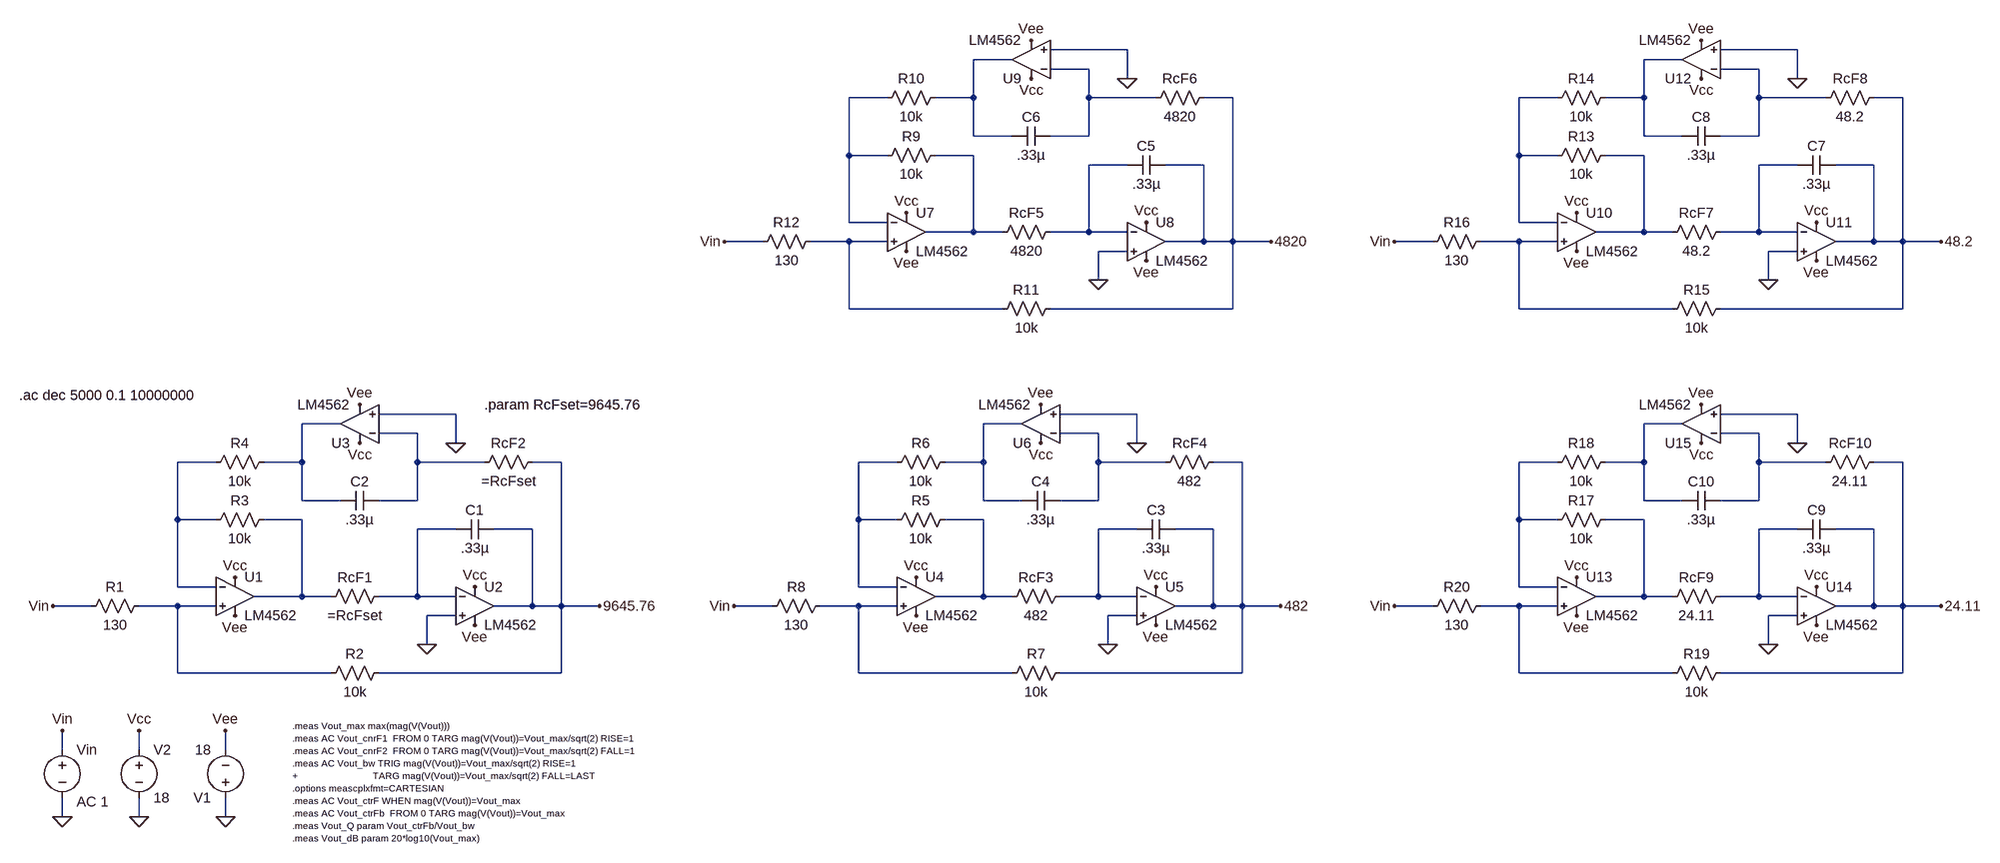
[diagram p0: schematic State-Variable Band Pass Testing.asc]
State-Variable Band Pass Testing.asc, the LTspice schematic file:
Version 4
SHEET 1 3892 728
WIRE 2432 -1712 2304 -1712
WIRE 3568 -1712 3440 -1712
WIRE 2240 -1696 2176 -1696
WIRE 3376 -1696 3312 -1696
WIRE 2368 -1680 2304 -1680
WIRE 3504 -1680 3440 -1680
WIRE 2432 -1664 2432 -1712
WIRE 3568 -1664 3568 -1712
WIRE 2032 -1632 1968 -1632
WIRE 2176 -1632 2176 -1696
WIRE 2176 -1632 2112 -1632
WIRE 2368 -1632 2368 -1680
WIRE 2480 -1632 2368 -1632
WIRE 2608 -1632 2560 -1632
WIRE 3168 -1632 3104 -1632
WIRE 3312 -1632 3312 -1696
WIRE 3312 -1632 3248 -1632
WIRE 3504 -1632 3504 -1680
WIRE 3616 -1632 3504 -1632
WIRE 3744 -1632 3696 -1632
WIRE 2176 -1568 2176 -1632
WIRE 2240 -1568 2176 -1568
WIRE 2368 -1568 2368 -1632
WIRE 2368 -1568 2304 -1568
WIRE 3312 -1568 3312 -1632
WIRE 3376 -1568 3312 -1568
WIRE 3504 -1568 3504 -1632
WIRE 3504 -1568 3440 -1568
WIRE 1968 -1536 1968 -1632
WIRE 2032 -1536 1968 -1536
WIRE 2176 -1536 2112 -1536
WIRE 3104 -1536 3104 -1632
WIRE 3168 -1536 3104 -1536
WIRE 3312 -1536 3248 -1536
WIRE 2432 -1520 2368 -1520
WIRE 2560 -1520 2496 -1520
WIRE 3568 -1520 3504 -1520
WIRE 3696 -1520 3632 -1520
WIRE 1968 -1424 1968 -1536
WIRE 2032 -1424 1968 -1424
WIRE 3104 -1424 3104 -1536
WIRE 3168 -1424 3104 -1424
WIRE 2176 -1408 2176 -1536
WIRE 2176 -1408 2096 -1408
WIRE 2224 -1408 2176 -1408
WIRE 2368 -1408 2368 -1520
WIRE 2368 -1408 2304 -1408
WIRE 2432 -1408 2368 -1408
WIRE 3312 -1408 3312 -1536
WIRE 3312 -1408 3232 -1408
WIRE 3360 -1408 3312 -1408
WIRE 3504 -1408 3504 -1520
WIRE 3504 -1408 3440 -1408
WIRE 3568 -1408 3504 -1408
WIRE 1824 -1392 1760 -1392
WIRE 1968 -1392 1904 -1392
WIRE 2032 -1392 1968 -1392
WIRE 2560 -1392 2560 -1520
WIRE 2560 -1392 2496 -1392
WIRE 2608 -1392 2608 -1632
WIRE 2608 -1392 2560 -1392
WIRE 2672 -1392 2608 -1392
WIRE 2960 -1392 2896 -1392
WIRE 3104 -1392 3040 -1392
WIRE 3168 -1392 3104 -1392
WIRE 3696 -1392 3696 -1520
WIRE 3696 -1392 3632 -1392
WIRE 3744 -1392 3744 -1632
WIRE 3744 -1392 3696 -1392
WIRE 3808 -1392 3744 -1392
WIRE 2432 -1376 2384 -1376
WIRE 3568 -1376 3520 -1376
WIRE 2384 -1328 2384 -1376
WIRE 3520 -1328 3520 -1376
WIRE 1968 -1280 1968 -1392
WIRE 2224 -1280 1968 -1280
WIRE 2608 -1280 2608 -1392
WIRE 2608 -1280 2304 -1280
WIRE 3104 -1280 3104 -1392
WIRE 3360 -1280 3104 -1280
WIRE 3744 -1280 3744 -1392
WIRE 3744 -1280 3440 -1280
WIRE 1312 -1104 1184 -1104
WIRE 2448 -1104 2320 -1104
WIRE 3568 -1104 3440 -1104
WIRE 1120 -1088 1056 -1088
WIRE 2256 -1088 2192 -1088
WIRE 3376 -1088 3312 -1088
WIRE 1248 -1072 1184 -1072
WIRE 2384 -1072 2320 -1072
WIRE 3504 -1072 3440 -1072
WIRE 1312 -1056 1312 -1104
WIRE 2448 -1056 2448 -1104
WIRE 3568 -1056 3568 -1104
WIRE 912 -1024 848 -1024
WIRE 1056 -1024 1056 -1088
WIRE 1056 -1024 992 -1024
WIRE 1248 -1024 1248 -1072
WIRE 1360 -1024 1248 -1024
WIRE 1488 -1024 1440 -1024
WIRE 2048 -1024 1984 -1024
WIRE 2192 -1024 2192 -1088
WIRE 2192 -1024 2128 -1024
WIRE 2384 -1024 2384 -1072
WIRE 2496 -1024 2384 -1024
WIRE 2624 -1024 2576 -1024
WIRE 3168 -1024 3104 -1024
WIRE 3312 -1024 3312 -1088
WIRE 3312 -1024 3248 -1024
WIRE 3504 -1024 3504 -1072
WIRE 3616 -1024 3504 -1024
WIRE 3744 -1024 3696 -1024
WIRE 1056 -960 1056 -1024
WIRE 1120 -960 1056 -960
WIRE 1248 -960 1248 -1024
WIRE 1248 -960 1184 -960
WIRE 2192 -960 2192 -1024
WIRE 2256 -960 2192 -960
WIRE 2384 -960 2384 -1024
WIRE 2384 -960 2320 -960
WIRE 3312 -960 3312 -1024
WIRE 3376 -960 3312 -960
WIRE 3504 -960 3504 -1024
WIRE 3504 -960 3440 -960
WIRE 848 -928 848 -1024
WIRE 912 -928 848 -928
WIRE 1056 -928 992 -928
WIRE 1984 -928 1984 -1024
WIRE 2048 -928 1984 -928
WIRE 2192 -928 2128 -928
WIRE 3104 -928 3104 -1024
WIRE 3168 -928 3104 -928
WIRE 3312 -928 3248 -928
WIRE 1312 -912 1248 -912
WIRE 1440 -912 1376 -912
WIRE 2448 -912 2384 -912
WIRE 2576 -912 2512 -912
WIRE 3568 -912 3504 -912
WIRE 3696 -912 3632 -912
WIRE 848 -816 848 -928
WIRE 912 -816 848 -816
WIRE 1984 -816 1984 -928
WIRE 2048 -816 1984 -816
WIRE 3104 -816 3104 -928
WIRE 3168 -816 3104 -816
WIRE 1056 -800 1056 -928
WIRE 1056 -800 976 -800
WIRE 1104 -800 1056 -800
WIRE 1248 -800 1248 -912
WIRE 1248 -800 1184 -800
WIRE 1312 -800 1248 -800
WIRE 2192 -800 2192 -928
WIRE 2192 -800 2112 -800
WIRE 2240 -800 2192 -800
WIRE 2384 -800 2384 -912
WIRE 2384 -800 2320 -800
WIRE 2448 -800 2384 -800
WIRE 3312 -800 3312 -928
WIRE 3312 -800 3232 -800
WIRE 3360 -800 3312 -800
WIRE 3504 -800 3504 -912
WIRE 3504 -800 3440 -800
WIRE 3568 -800 3504 -800
WIRE 704 -784 640 -784
WIRE 848 -784 784 -784
WIRE 912 -784 848 -784
WIRE 1440 -784 1440 -912
WIRE 1440 -784 1376 -784
WIRE 1488 -784 1488 -1024
WIRE 1488 -784 1440 -784
WIRE 1552 -784 1488 -784
WIRE 1840 -784 1776 -784
WIRE 1984 -784 1920 -784
WIRE 2048 -784 1984 -784
WIRE 2576 -784 2576 -912
WIRE 2576 -784 2512 -784
WIRE 2624 -784 2624 -1024
WIRE 2624 -784 2576 -784
WIRE 2688 -784 2624 -784
WIRE 2960 -784 2896 -784
WIRE 3104 -784 3040 -784
WIRE 3168 -784 3104 -784
WIRE 3696 -784 3696 -912
WIRE 3696 -784 3632 -784
WIRE 3744 -784 3744 -1024
WIRE 3744 -784 3696 -784
WIRE 3808 -784 3744 -784
WIRE 1312 -768 1264 -768
WIRE 2448 -768 2400 -768
WIRE 3568 -768 3520 -768
WIRE 1264 -720 1264 -768
WIRE 2400 -720 2400 -768
WIRE 3520 -720 3520 -768
WIRE 848 -672 848 -784
WIRE 1104 -672 848 -672
WIRE 1488 -672 1488 -784
WIRE 1488 -672 1184 -672
WIRE 1984 -672 1984 -784
WIRE 2240 -672 1984 -672
WIRE 2624 -672 2624 -784
WIRE 2624 -672 2320 -672
WIRE 3104 -672 3104 -784
WIRE 3360 -672 3104 -672
WIRE 3744 -672 3744 -784
WIRE 3744 -672 3440 -672
WIRE 656 -544 656 -576
WIRE 784 -544 784 -576
WIRE 928 -544 928 -576
WIRE 656 -432 656 -464
WIRE 784 -432 784 -464
WIRE 928 -432 928 -464
FLAG 656 -432 0
FLAG 784 -576 Vcc
FLAG 928 -576 Vee
FLAG 928 -432 0
FLAG 784 -432 0
FLAG 656 -576 Vin
FLAG 1264 -720 0
FLAG 1552 -784 9645.76
FLAG 640 -784 Vin
FLAG 1312 -1056 0
FLAG 1344 -816 Vcc
FLAG 1152 -1056 Vcc
FLAG 944 -832 Vcc
FLAG 1344 -752 Vee
FLAG 944 -768 Vee
FLAG 1152 -1120 Vee
FLAG 2400 -720 0
FLAG 2688 -784 482
FLAG 1776 -784 Vin
FLAG 2448 -1056 0
FLAG 2480 -816 Vcc
FLAG 2288 -1056 Vcc
FLAG 2080 -832 Vcc
FLAG 2480 -752 Vee
FLAG 2080 -768 Vee
FLAG 2288 -1120 Vee
FLAG 2384 -1328 0
FLAG 2672 -1392 4820
FLAG 1760 -1392 Vin
FLAG 2432 -1664 0
FLAG 2464 -1424 Vcc
FLAG 2272 -1664 Vcc
FLAG 2064 -1440 Vcc
FLAG 2464 -1360 Vee
FLAG 2064 -1376 Vee
FLAG 2272 -1728 Vee
FLAG 3520 -1328 0
FLAG 3808 -1392 48.2
FLAG 2896 -1392 Vin
FLAG 3568 -1664 0
FLAG 3600 -1424 Vcc
FLAG 3408 -1664 Vcc
FLAG 3200 -1440 Vcc
FLAG 3600 -1360 Vee
FLAG 3200 -1376 Vee
FLAG 3408 -1728 Vee
FLAG 3520 -720 0
FLAG 3808 -784 24.11
FLAG 2896 -784 Vin
FLAG 3568 -1056 0
FLAG 3600 -816 Vcc
FLAG 3408 -1056 Vcc
FLAG 3200 -832 Vcc
FLAG 3600 -752 Vee
FLAG 3200 -768 Vee
FLAG 3408 -1120 Vee
SYMBOL voltage 656 -560 R0
WINDOW 123 24 103 Left 2
WINDOW 39 0 0 Left 0
SYMATTR Value2 AC 1
SYMATTR InstName Vin
SYMATTR Value ""
SYMBOL voltage 784 -560 R0
WINDOW 123 0 0 Left 0
WINDOW 39 0 0 Left 0
SYMATTR InstName V2
SYMATTR Value 18
SYMBOL voltage 928 -448 R180
WINDOW 123 0 0 Left 0
WINDOW 39 0 0 Left 0
SYMATTR InstName V1
SYMATTR Value 18
SYMBOL OpAmps\\LM4562 944 -800 R0
SYMATTR InstName U1
SYMBOL res 1200 -816 R90
WINDOW 0 0 56 VBottom 2
WINDOW 3 32 56 VTop 2
SYMATTR InstName RcF1
SYMATTR Value =RcFset
SYMBOL OpAmps\\LM4562 1344 -784 R0
SYMATTR InstName U2
SYMBOL OpAmps\\LM4562 1152 -1088 R180
SYMATTR InstName U3
SYMBOL cap 1376 -928 R90
WINDOW 0 0 32 VBottom 2
WINDOW 3 32 32 VTop 2
SYMATTR InstName C1
SYMATTR Value .33µ
SYMBOL res 1008 -944 R90
WINDOW 0 0 56 VBottom 2
WINDOW 3 32 56 VTop 2
SYMATTR InstName R3
SYMATTR Value 10k
SYMBOL cap 1184 -976 R90
WINDOW 0 0 32 VBottom 2
WINDOW 3 32 32 VTop 2
SYMATTR InstName C2
SYMATTR Value .33µ
SYMBOL res 1456 -1040 R90
WINDOW 0 0 56 VBottom 2
WINDOW 3 32 56 VTop 2
SYMATTR InstName RcF2
SYMATTR Value =RcFset
SYMBOL res 1008 -1040 R90
WINDOW 0 0 56 VBottom 2
WINDOW 3 32 56 VTop 2
SYMATTR InstName R4
SYMATTR Value 10k
SYMBOL res 1200 -688 R90
WINDOW 0 0 56 VBottom 2
WINDOW 3 32 56 VTop 2
SYMATTR InstName R2
SYMATTR Value 10k
SYMBOL res 800 -800 R90
WINDOW 0 0 56 VBottom 2
WINDOW 3 32 56 VTop 2
SYMATTR InstName R1
SYMATTR Value 130
SYMBOL OpAmps\\LM4562 2080 -800 R0
SYMATTR InstName U4
SYMBOL res 2336 -816 R90
WINDOW 0 0 56 VBottom 2
WINDOW 3 32 56 VTop 2
SYMATTR InstName RcF3
SYMATTR Value 482
SYMBOL OpAmps\\LM4562 2480 -784 R0
SYMATTR InstName U5
SYMBOL OpAmps\\LM4562 2288 -1088 R180
SYMATTR InstName U6
SYMBOL cap 2512 -928 R90
WINDOW 0 0 32 VBottom 2
WINDOW 3 32 32 VTop 2
SYMATTR InstName C3
SYMATTR Value .33µ
SYMBOL res 2144 -944 R90
WINDOW 0 0 56 VBottom 2
WINDOW 3 32 56 VTop 2
SYMATTR InstName R5
SYMATTR Value 10k
SYMBOL cap 2320 -976 R90
WINDOW 0 0 32 VBottom 2
WINDOW 3 32 32 VTop 2
SYMATTR InstName C4
SYMATTR Value .33µ
SYMBOL res 2592 -1040 R90
WINDOW 0 0 56 VBottom 2
WINDOW 3 32 56 VTop 2
SYMATTR InstName RcF4
SYMATTR Value 482
SYMBOL res 2144 -1040 R90
WINDOW 0 0 56 VBottom 2
WINDOW 3 32 56 VTop 2
SYMATTR InstName R6
SYMATTR Value 10k
SYMBOL res 2336 -688 R90
WINDOW 0 0 56 VBottom 2
WINDOW 3 32 56 VTop 2
SYMATTR InstName R7
SYMATTR Value 10k
SYMBOL res 1936 -800 R90
WINDOW 0 0 56 VBottom 2
WINDOW 3 32 56 VTop 2
SYMATTR InstName R8
SYMATTR Value 130
SYMBOL OpAmps\\LM4562 2064 -1408 R0
SYMATTR InstName U7
SYMBOL res 2320 -1424 R90
WINDOW 0 0 56 VBottom 2
WINDOW 3 32 56 VTop 2
SYMATTR InstName RcF5
SYMATTR Value 4820
SYMBOL OpAmps\\LM4562 2464 -1392 R0
SYMATTR InstName U8
SYMBOL OpAmps\\LM4562 2272 -1696 R180
SYMATTR InstName U9
SYMBOL cap 2496 -1536 R90
WINDOW 0 0 32 VBottom 2
WINDOW 3 32 32 VTop 2
SYMATTR InstName C5
SYMATTR Value .33µ
SYMBOL res 2128 -1552 R90
WINDOW 0 0 56 VBottom 2
WINDOW 3 32 56 VTop 2
SYMATTR InstName R9
SYMATTR Value 10k
SYMBOL cap 2304 -1584 R90
WINDOW 0 0 32 VBottom 2
WINDOW 3 32 32 VTop 2
SYMATTR InstName C6
SYMATTR Value .33µ
SYMBOL res 2576 -1648 R90
WINDOW 0 0 56 VBottom 2
WINDOW 3 32 56 VTop 2
SYMATTR InstName RcF6
SYMATTR Value 4820
SYMBOL res 2128 -1648 R90
WINDOW 0 0 56 VBottom 2
WINDOW 3 32 56 VTop 2
SYMATTR InstName R10
SYMATTR Value 10k
SYMBOL res 2320 -1296 R90
WINDOW 0 0 56 VBottom 2
WINDOW 3 32 56 VTop 2
SYMATTR InstName R11
SYMATTR Value 10k
SYMBOL res 1920 -1408 R90
WINDOW 0 0 56 VBottom 2
WINDOW 3 32 56 VTop 2
SYMATTR InstName R12
SYMATTR Value 130
SYMBOL OpAmps\\LM4562 3200 -1408 R0
SYMATTR InstName U10
SYMBOL res 3456 -1424 R90
WINDOW 0 0 56 VBottom 2
WINDOW 3 32 56 VTop 2
SYMATTR InstName RcF7
SYMATTR Value 48.2
SYMBOL OpAmps\\LM4562 3600 -1392 R0
SYMATTR InstName U11
SYMBOL OpAmps\\LM4562 3408 -1696 R180
SYMATTR InstName U12
SYMBOL cap 3632 -1536 R90
WINDOW 0 0 32 VBottom 2
WINDOW 3 32 32 VTop 2
SYMATTR InstName C7
SYMATTR Value .33µ
SYMBOL res 3264 -1552 R90
WINDOW 0 0 56 VBottom 2
WINDOW 3 32 56 VTop 2
SYMATTR InstName R13
SYMATTR Value 10k
SYMBOL cap 3440 -1584 R90
WINDOW 0 0 32 VBottom 2
WINDOW 3 32 32 VTop 2
SYMATTR InstName C8
SYMATTR Value .33µ
SYMBOL res 3712 -1648 R90
WINDOW 0 0 56 VBottom 2
WINDOW 3 32 56 VTop 2
SYMATTR InstName RcF8
SYMATTR Value 48.2
SYMBOL res 3264 -1648 R90
WINDOW 0 0 56 VBottom 2
WINDOW 3 32 56 VTop 2
SYMATTR InstName R14
SYMATTR Value 10k
SYMBOL res 3456 -1296 R90
WINDOW 0 0 56 VBottom 2
WINDOW 3 32 56 VTop 2
SYMATTR InstName R15
SYMATTR Value 10k
SYMBOL res 3056 -1408 R90
WINDOW 0 0 56 VBottom 2
WINDOW 3 32 56 VTop 2
SYMATTR InstName R16
SYMATTR Value 130
SYMBOL OpAmps\\LM4562 3200 -800 R0
SYMATTR InstName U13
SYMBOL res 3456 -816 R90
WINDOW 0 0 56 VBottom 2
WINDOW 3 32 56 VTop 2
SYMATTR InstName RcF9
SYMATTR Value 24.11
SYMBOL OpAmps\\LM4562 3600 -784 R0
SYMATTR InstName U14
SYMBOL OpAmps\\LM4562 3408 -1088 R180
SYMATTR InstName U15
SYMBOL cap 3632 -928 R90
WINDOW 0 0 32 VBottom 2
WINDOW 3 32 32 VTop 2
SYMATTR InstName C9
SYMATTR Value .33µ
SYMBOL res 3264 -944 R90
WINDOW 0 0 56 VBottom 2
WINDOW 3 32 56 VTop 2
SYMATTR InstName R17
SYMATTR Value 10k
SYMBOL cap 3440 -976 R90
WINDOW 0 0 32 VBottom 2
WINDOW 3 32 32 VTop 2
SYMATTR InstName C10
SYMATTR Value .33µ
SYMBOL res 3712 -1040 R90
WINDOW 0 0 56 VBottom 2
WINDOW 3 32 56 VTop 2
SYMATTR InstName RcF10
SYMATTR Value 24.11
SYMBOL res 3264 -1040 R90
WINDOW 0 0 56 VBottom 2
WINDOW 3 32 56 VTop 2
SYMATTR InstName R18
SYMATTR Value 10k
SYMBOL res 3456 -688 R90
WINDOW 0 0 56 VBottom 2
WINDOW 3 32 56 VTop 2
SYMATTR InstName R19
SYMATTR Value 10k
SYMBOL res 3056 -800 R90
WINDOW 0 0 56 VBottom 2
WINDOW 3 32 56 VTop 2
SYMATTR InstName R20
SYMATTR Value 130
TEXT 584 -1136 Left 2 !.ac dec 5000 0.1 10000000
TEXT 1040 -584 Left 1 !.meas Vout_max max(mag(V(Vout)))\n.meas AC Vout_cnrF1  FROM 0 TARG mag(V(Vout))=Vout_max/sqrt(2) RISE=1\n.meas AC Vout_cnrF2  FROM 0 TARG mag(V(Vout))=Vout_max/sqrt(2) FALL=1\n.meas AC Vout_bw TRIG mag(V(Vout))=Vout_max/sqrt(2) RISE=1\n+                              TARG mag(V(Vout))=Vout_max/sqrt(2) FALL=LAST\n.options meascplxfmt=CARTESIAN\n.meas AC Vout_ctrF WHEN mag(V(Vout))=Vout_max\n.meas AC Vout_ctrFb  FROM 0 TARG mag(V(Vout))=Vout_max\n.meas Vout_Q param Vout_ctrFb/Vout_bw\n.meas Vout_dB param 20*log10(Vout_max)
TEXT 1360 -1120 Left 2 !.param RcFset=9645.76

The netlist it stands for:
* State-Variable Band Pass Testing.asc
Vin Vin 0 AC 1
V2 Vcc 0 18
V1 0 Vee 18
* U1: LM4562 (symbol OpAmps\LM4562 not available, pins judged from their places): In+=N028 In-=N019 V+=Vcc V-=Vee OUT=N022
RcF1 N025 N022 =RcFset
* U2: LM4562 (symbol OpAmps\LM4562 not available, pins judged from their places): In+=0 In-=N025 V+=Vcc V-=Vee OUT=9645.76
* U3: LM4562 (symbol OpAmps\LM4562 not available, pins judged from their places): In+=0 In-=N016 V+=Vcc V-=Vee OUT=N013
C1 9645.76 N025 .33µ
R3 N022 N019 10k
C2 N016 N013 .33µ
RcF2 9645.76 N016 =RcFset
R4 N013 N019 10k
R2 9645.76 N028 10k
R1 N028 Vin 130
* U4: LM4562 (symbol OpAmps\LM4562 not available, pins judged from their places): In+=N029 In-=N020 V+=Vcc V-=Vee OUT=N023
RcF3 N026 N023 482
* U5: LM4562 (symbol OpAmps\LM4562 not available, pins judged from their places): In+=0 In-=N026 V+=Vcc V-=Vee OUT=482
* U6: LM4562 (symbol OpAmps\LM4562 not available, pins judged from their places): In+=0 In-=N017 V+=Vcc V-=Vee OUT=N014
C3 482 N026 .33µ
R5 N023 N020 10k
C4 N017 N014 .33µ
RcF4 482 N017 482
R6 N014 N020 10k
R7 482 N029 10k
R8 N029 Vin 130
* U7: LM4562 (symbol OpAmps\LM4562 not available, pins judged from their places): In+=N011 In-=N005 V+=Vcc V-=Vee OUT=N007
RcF5 N009 N007 4820
* U8: LM4562 (symbol OpAmps\LM4562 not available, pins judged from their places): In+=0 In-=N009 V+=Vcc V-=Vee OUT=4820
* U9: LM4562 (symbol OpAmps\LM4562 not available, pins judged from their places): In+=0 In-=N003 V+=Vcc V-=Vee OUT=N001
C5 4820 N009 .33µ
R9 N007 N005 10k
C6 N003 N001 .33µ
RcF6 4820 N003 4820
R10 N001 N005 10k
R11 4820 N011 10k
R12 N011 Vin 130
* U10: LM4562 (symbol OpAmps\LM4562 not available, pins judged from their places): In+=N012 In-=N006 V+=Vcc V-=Vee OUT=N008
RcF7 N010 N008 48.2
* U11: LM4562 (symbol OpAmps\LM4562 not available, pins judged from their places): In+=0 In-=N010 V+=Vcc V-=Vee OUT=48.2
* U12: LM4562 (symbol OpAmps\LM4562 not available, pins judged from their places): In+=0 In-=N004 V+=Vcc V-=Vee OUT=N002
C7 48.2 N010 .33µ
R13 N008 N006 10k
C8 N004 N002 .33µ
RcF8 48.2 N004 48.2
R14 N002 N006 10k
R15 48.2 N012 10k
R16 N012 Vin 130
* U13: LM4562 (symbol OpAmps\LM4562 not available, pins judged from their places): In+=N030 In-=N021 V+=Vcc V-=Vee OUT=N024
RcF9 N027 N024 24.11
* U14: LM4562 (symbol OpAmps\LM4562 not available, pins judged from their places): In+=0 In-=N027 V+=Vcc V-=Vee OUT=24.11
* U15: LM4562 (symbol OpAmps\LM4562 not available, pins judged from their places): In+=0 In-=N018 V+=Vcc V-=Vee OUT=N015
C9 24.11 N027 .33µ
R17 N024 N021 10k
C10 N018 N015 .33µ
RcF10 24.11 N018 24.11
R18 N015 N021 10k
R19 24.11 N030 10k
R20 N030 Vin 130
.ac dec 5000 0.1 10000000
.meas Vout_max max(mag(V(Vout)))
.meas AC Vout_cnrF1  FROM 0 TARG mag(V(Vout))=Vout_max/sqrt(2) RISE=1
.meas AC Vout_cnrF2  FROM 0 TARG mag(V(Vout))=Vout_max/sqrt(2) FALL=1
.meas AC Vout_bw TRIG mag(V(Vout))=Vout_max/sqrt(2) RISE=1
+                              TARG mag(V(Vout))=Vout_max/sqrt(2) FALL=LAST
.options meascplxfmt=CARTESIAN
.meas AC Vout_ctrF WHEN mag(V(Vout))=Vout_max
.meas AC Vout_ctrFb  FROM 0 TARG mag(V(Vout))=Vout_max
.meas Vout_Q param Vout_ctrFb/Vout_bw
.meas Vout_dB param 20*log10(Vout_max)
.param RcFset=9645.76
.backanno
.end